# EAGLE schematic SwitchModePowerSupply (EAGLE 9.7.0)
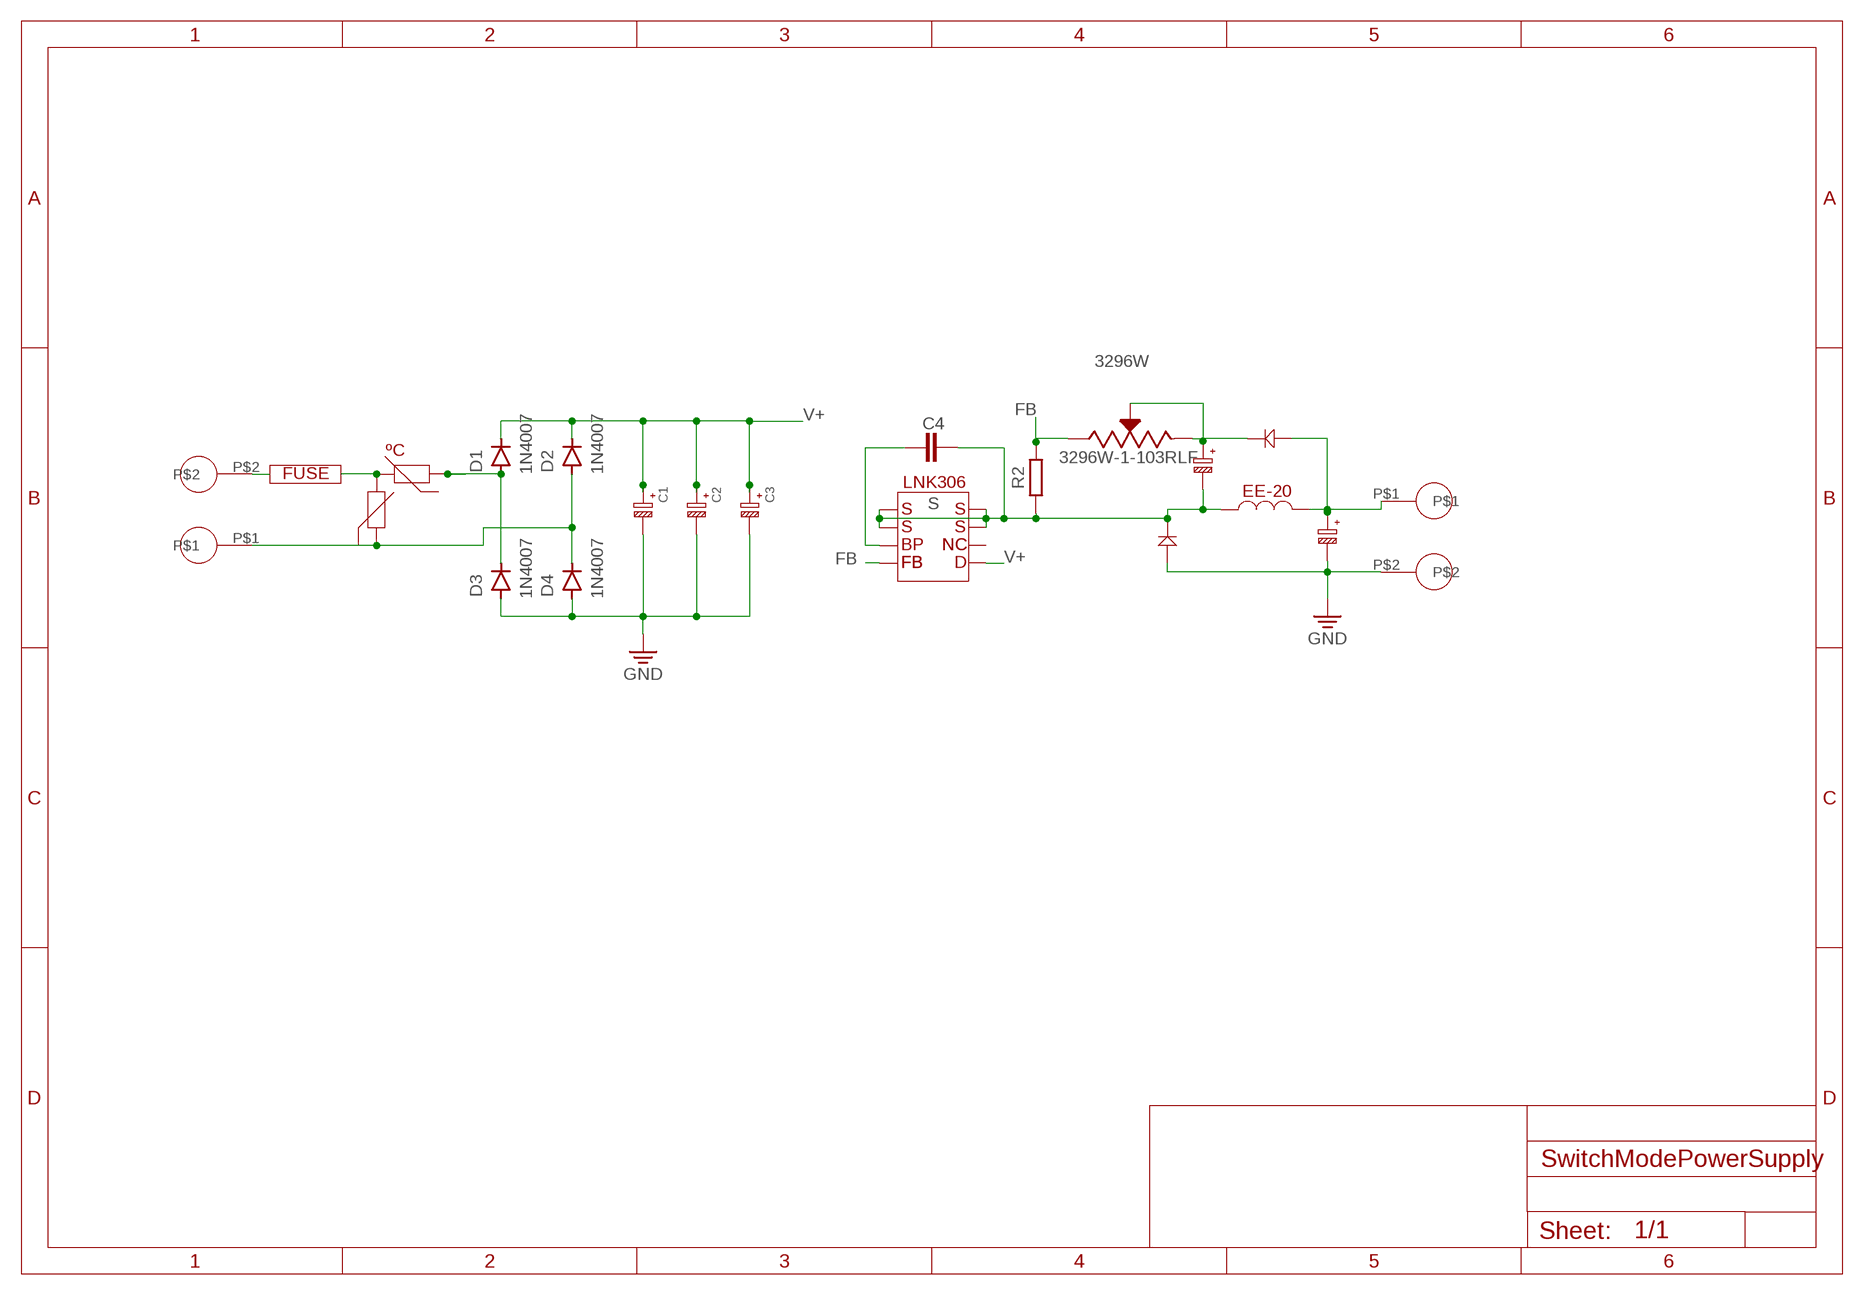
[diagram p0: schematic, sheet 1]

## Parts
3296W  3296W-1-103RLF  [TRIM_3296W-1-103RLF]
A2  SOCKET_FUSE  [SOCKET_FUS_FOOTPRINT]
C1  CAPACITOR_POL_10X13  [CAPACITOR_10X13_FOOTPRINT]
C2  CAPACITOR_POL_10X13  [CAPACITOR_10X13_FOOTPRINT]
C3  CAPACITOR_POL_10X13  [CAPACITOR_10X13_FOOTPRINT]
C4  CAPACITORCERAMIC-2.54MM  [CAP-THRU-2.54MM]
D1  1N4007  [DO-41]
D2  1N4007  [DO-41]
D3  1N4007  [DO-41]
D4  1N4007  [DO-41]
R2  R_AXIAL-7.2MM-PITCH  [RESAD724W46L381D178B]
S05K300  NTC-20R  [NTC_FOOTPRINT]
U$1  BORNE-2-VIAS-COMPONENTE  [BORNE-2-VIAS-FOOTPRINT]
U$2  VARISTOR_5D  [VARISTOR_5D_FOOTPRINT]
U$3  INDUTOR_EE_20  [INDUTOR_EE_20_FOOTPRINT]
U$4  BORNE-2-VIAS-COMPONENTE  [BORNE-2-VIAS-FOOTPRINT]
U$5  LNK306P  [LNK306P_FOOTPRINT]
U$6  CAPACITOR_SANYO_22UF  [CAPACITOR_FOOTPRINT]
U$7  UF4007  [UF4007_FOOTPRINT]
U$8  UF4007  [UF4007_FOOTPRINT]
U$9  CAPACITOR_SANYO_22UF  [CAPACITOR_FOOTPRINT]

## Nets
FB: 3296W.1(CCW) R2.2 U$5.P$4
GND: C1.P$2 C2.P$2 C3.P$2 D3.A D4.A U$4.P$2 U$6.P$2 U$7.P$1
N$1: A2.P$2 S05K300.P$1 U$2.P$1
N$2: U$3.P$3 U$4.P$1 U$6.P$1 U$8.P$1
N$3: A2.P$1 U$1.P$2
N$4: 3296W.2(WIPER) 3296W.3(CW) U$8.P$2 U$9.P$1
N$5: D1.A D3.C S05K300.P$2
N$6: D2.A D4.C U$1.P$1 U$2.P$2
N$8: C4.2 U$5.P$3
S: C4.1 R2.1 U$3.P$1 U$5.P$1 U$5.P$2 U$5.P$7 U$5.P$8 U$7.P$2 U$9.P$2
V+: C1.P$1 C2.P$1 C3.P$1 D1.C D2.C U$5.P$5
Unconnected: U$5.P$6

## Library data of the parts
3296W = POT-MULTIVOLTAS:3296W-1-103RLF: Check availability <https://pricing.snapeda.com/parts/3296W-1-103RLF/Bourns/view-part?ref=eda>; AVAILABILITY: In Stock; CHECK_PRICES: https://www.snapeda.com/parts/3296W-1-103RLF/Bourns/view-part/?ref=eda; DESCRIPTION: Trimmer, Cermet, Rest 10 Kilohms, PCB, 25 Turns, Pwr-Rtg 0.5W | Bourns 3296W-1-103RLF; MF: Bourns; MP: 3296W-1-103RLF; PACKAGE: NON STANDARD-3 Bourns; PRICE: None; SNAPEDA_LINK: https://www.snapeda.com/parts/3296W-1-103RLF/Bourns/view-part/?ref=snap
A2 = SOCKET_FUSE:SOCKET_FUSE
C1-C3 = CAPACITOR_10x13:CAPACITOR_POL_10X13
C4 = LED_PTH_ILHA_LONGA:CAPACITOR: Capacitor - Generic
D1-D4 = Diodes:1N4007: DIODE GEN PURP 1KV 1A DO41 Manufacturer's datasheet <https://www.mccsemi.com/pdf/Products/1N4001-1N4007(DO-41).pdf>; CREATED_BY: PCBLayout.com; DIGIKEY_PART_NUMBER: 1N4007MSCT-ND; MANUFACTURER: Micro Commercial Co; MPN: 1N4007; PACKAGE: DO-41
R2 = RESISTOR_ILHAS_LONGAS:R: Resistor Fixed - Generic; CATEGORY: Resistor; SUB-CATEGORY: Fixed
S05K300 = NTC-20R:NTC-20R
U$1 U$4 = borne-2-vias:BORNE-2-VIAS-COMPONENTE
U$2 = VARISTOR_5D:VARISTOR_5D
U$3 = INDUTOR_EE_20:INDUTOR_EE_20
U$5 = LNK306P:LNK306P
U$6 U$9 = CAPACITRO_SANYO_22uF:CAPACITOR_SANYO_22UF
U$7 U$8 = UF4007:UF4007